# Altium schematic sheet LVDS.SchDoc
size 420 x 297 mm; SheetNumber: 1; SheetTotal: 2
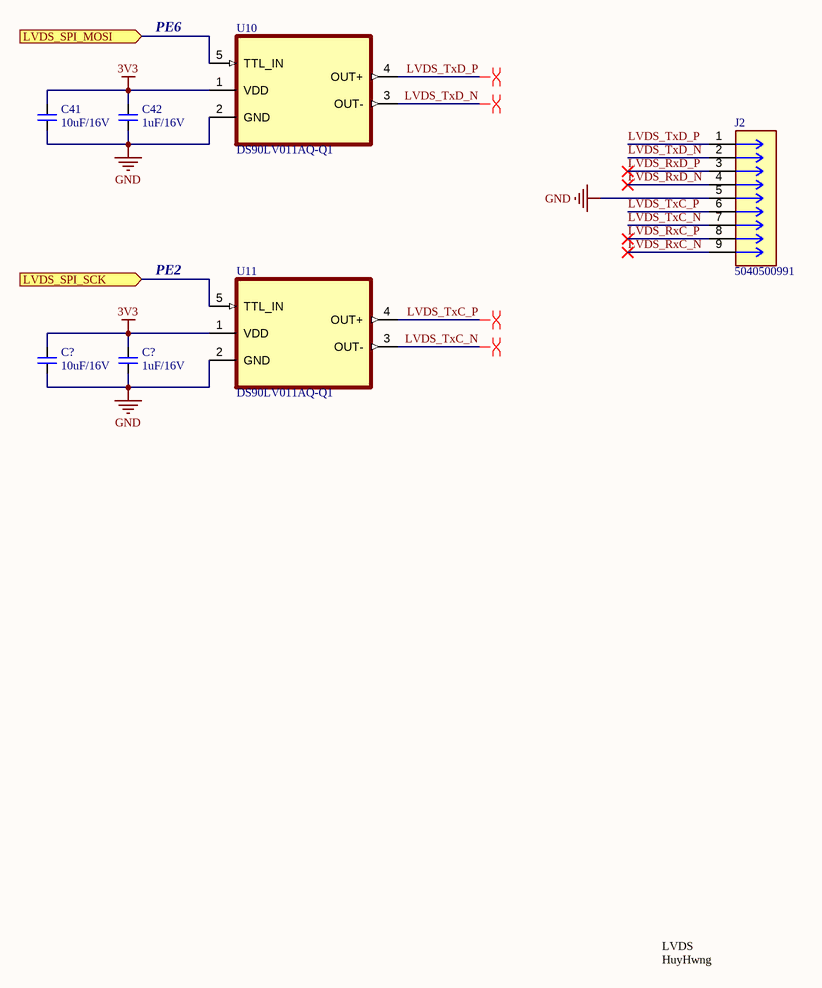
[diagram p0: LVDS.SchDoc]

## Parts
(Parts that share a designator on the sheet are numbered #1, #2 ... from top to bottom, then left to right.)
C41  10uF/16V  [CAP_C_1608X80]
C42  1uF/16V  [CAP_C_1608X80]
C?#1  10uF/16V  [CAP_C_1608X80]
C?#2  1uF/16V  [CAP_C_1608X80]
J2  5040500991  [5040500991]
U10  DS90LV011AQ-Q1  [DS90LV011AQ-Q1]
U11  DS90LV011AQ-Q1  [DS90LV011AQ-Q1]

## Ports
LVDS_SPI_MOSI (in), LVDS_SPI_SCK (in)

## Nets
3V3: C41.2 C42.2 C?#1.2 C?#2.2 U10.1(VDD) U11.1(VDD)
GND: C41.1 C42.1 C?#1.1 C?#2.1 J2.5 U10.2(GND) U11.2(GND)
LVDS_RxC_N: J2.9
LVDS_RxC_P: J2.8
LVDS_RxD_N: J2.4
LVDS_RxD_P: J2.3
LVDS_SPI_MOSI: U10.5(TTL_IN) ; port LVDS_SPI_MOSI
LVDS_SPI_SCK: U11.5(TTL_IN) ; port LVDS_SPI_SCK
LVDS_TxC_N: J2.7 U11.3(OUT-)
LVDS_TxC_P: J2.6 U11.4(OUT+)
LVDS_TxD_N: J2.2 U10.3(OUT-)
LVDS_TxD_P: J2.1 U10.4(OUT+)

## Layout directives
differential pair: LVDS_TxC_N, LVDS_TxC_P, LVDS_TxD_N, LVDS_TxD_P

## Notes on the sheet
- PE6
- PE2
- LVDS
- HuyHwng
- Sub-system:
- Design by:
- Sheet title:
- Project:
- Sheet:
- of
- Checked by:
- Approved by:
- Doc no:
- Revision:
- Size:
- Date:

## Library data of the parts
C41 C42 C?#1 C?#2 = CAP_SMD: CAP_Chip; Value: 33pF
J2 = 5040500991: Connector Header Surface Mount, Right Angle 9 position 0.059" (1.50mm)
U10 U11 = DS90LV011AQ-Q1: Automotive LVDS Differential Driver